# EAGLE schematic Slave (EAGLE 8.2.1)
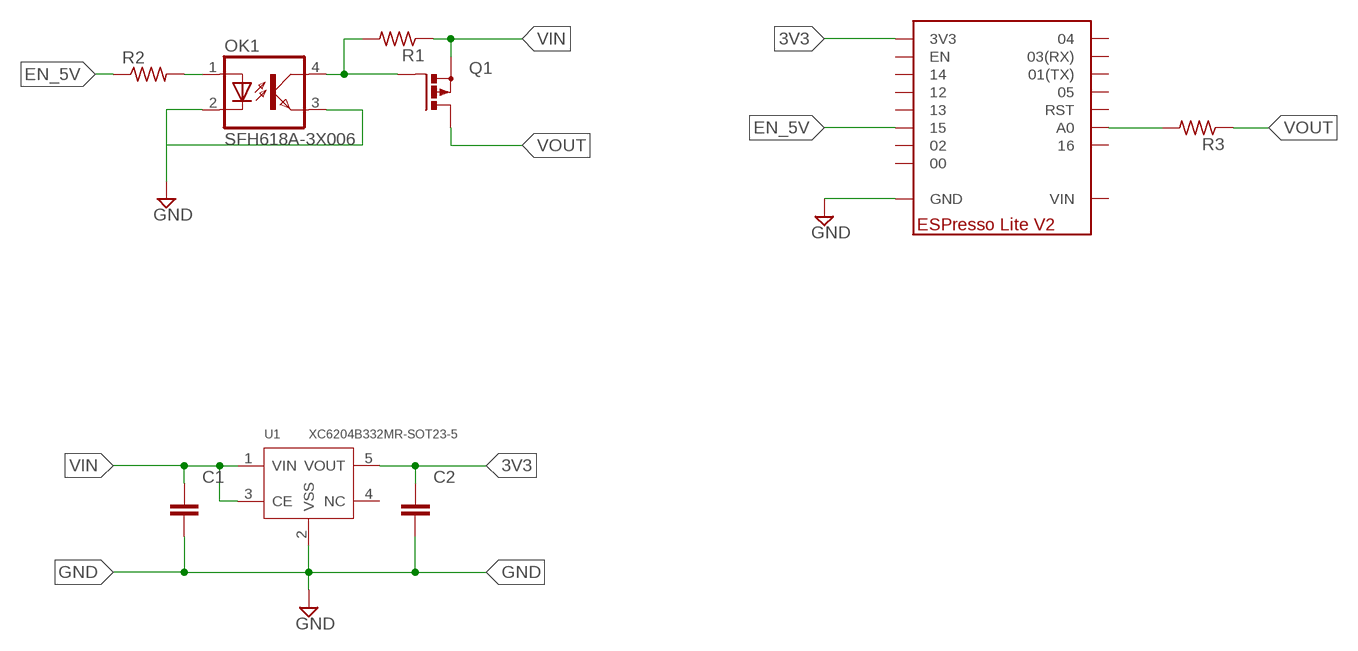
[diagram p0: schematic, sheet 1]

## Parts
C1  CAPACITOR_NPOL-1206  [C1206]
C2  CAPACITOR_NPOL-1206  [C1206]
OK1  SFH618A-3X006  [DIP4-400]
Q1  P-MOSFET-SO8  [SO-08]
R1  R-US_M0805  [M0805]
R2  R-US_M0805  [M0805]
R3  R-US_M0805  [M0805]
U1  XC6204B332MR-SOT23-5  PMIC-LDO-XC6204B332MR(SOT23-5)  [SOT-23-5]
U$1  ESPRESSO-LITE-V2  [ESPRESSO-LITE-V2]

## Nets
3V3: C2.1 U1.5(VOUT) U$1.3V3
EN_5V: R2.1 U$1.15
GND: C1.2 C2.2 OK1.3(EMIT) U1.2(VSS) U$1.GND1(GND) U$1.GND2(GND) U$1.GND3(GND)
N$1: OK1.1(A) R2.2
N$2: OK1.4(COL) Q1.4(G) R1.2
N$3: R3.2 U$1.AO(A0)
N$4: OK1.2(C)
VIN: C1.1 Q1.1(S) Q1.2(S) Q1.3(S) R1.1 U1.1(VIN) U1.3(CE)
VOUT: Q1.5(D) Q1.6(D) Q1.7(D) Q1.8(D) R3.1
Unconnected: U1.4(NC) U$1.00 U$1.01(01(TX)) U$1.02 U$1.03(03(RX)) U$1.04 U$1.05 U$1.12 U$1.13 U$1.14 U$1.16 U$1.EN U$1.RST U$1.VIN1(VIN) U$1.VIN2(VIN)

## Library data of the parts
C1 C2 = dp_devices:CAPACITOR_NPOL: Non-Polarized capacitor in various packages
OK1 = optocoupler:SFH618?*: Optocoupler, Phototransistor Output, Low Input Current Source: Data sheet <http://www.vishay.com/docs/83673/sfh618.pdf>; MPN: SFH618A-3X006; OC_FARNELL: unknown; OC_NEWARK: 43K9541
Q1 = transistor-power:P-MOSFET-SO8: P-Channel MOSFET Example: FDS4435A; P-Channel Logic Level PowerTrench® MOSFET FDS4465; P-Channel 1.8V Specified PowerTrench® MOSFET Source: www.fairchildsemi.com
R1-R3 = adafruit:R-US_: RESISTOR, American symbol
U1 = IC-2016:PMIC-LDO-XC6204B332MR(SOT23-5): 310030046; MPN: XC6204B332MR
U$1 = cmmc_lbr1:ESPRESSO-LITE-V2